# Altium schematic sheet Bpod_Controller_v5.SchDoc: Bpod Controller
size A3; CompanyName: Forschungszentrum Jülich GmbH; DrawnBy: D. Hellenbrandt; Organization: IBI-TAE; Address1: Wilhelm-Johnen-Straße; Address2: 52428 Jülich; DocumentNumber: PWxxxx; Revision: 1; SheetNumber: 1; SheetTotal: 1; Title2: v5; ImagePath: C:\Users\d.hellenbrandt\Bilder\FZJ-Logo.png
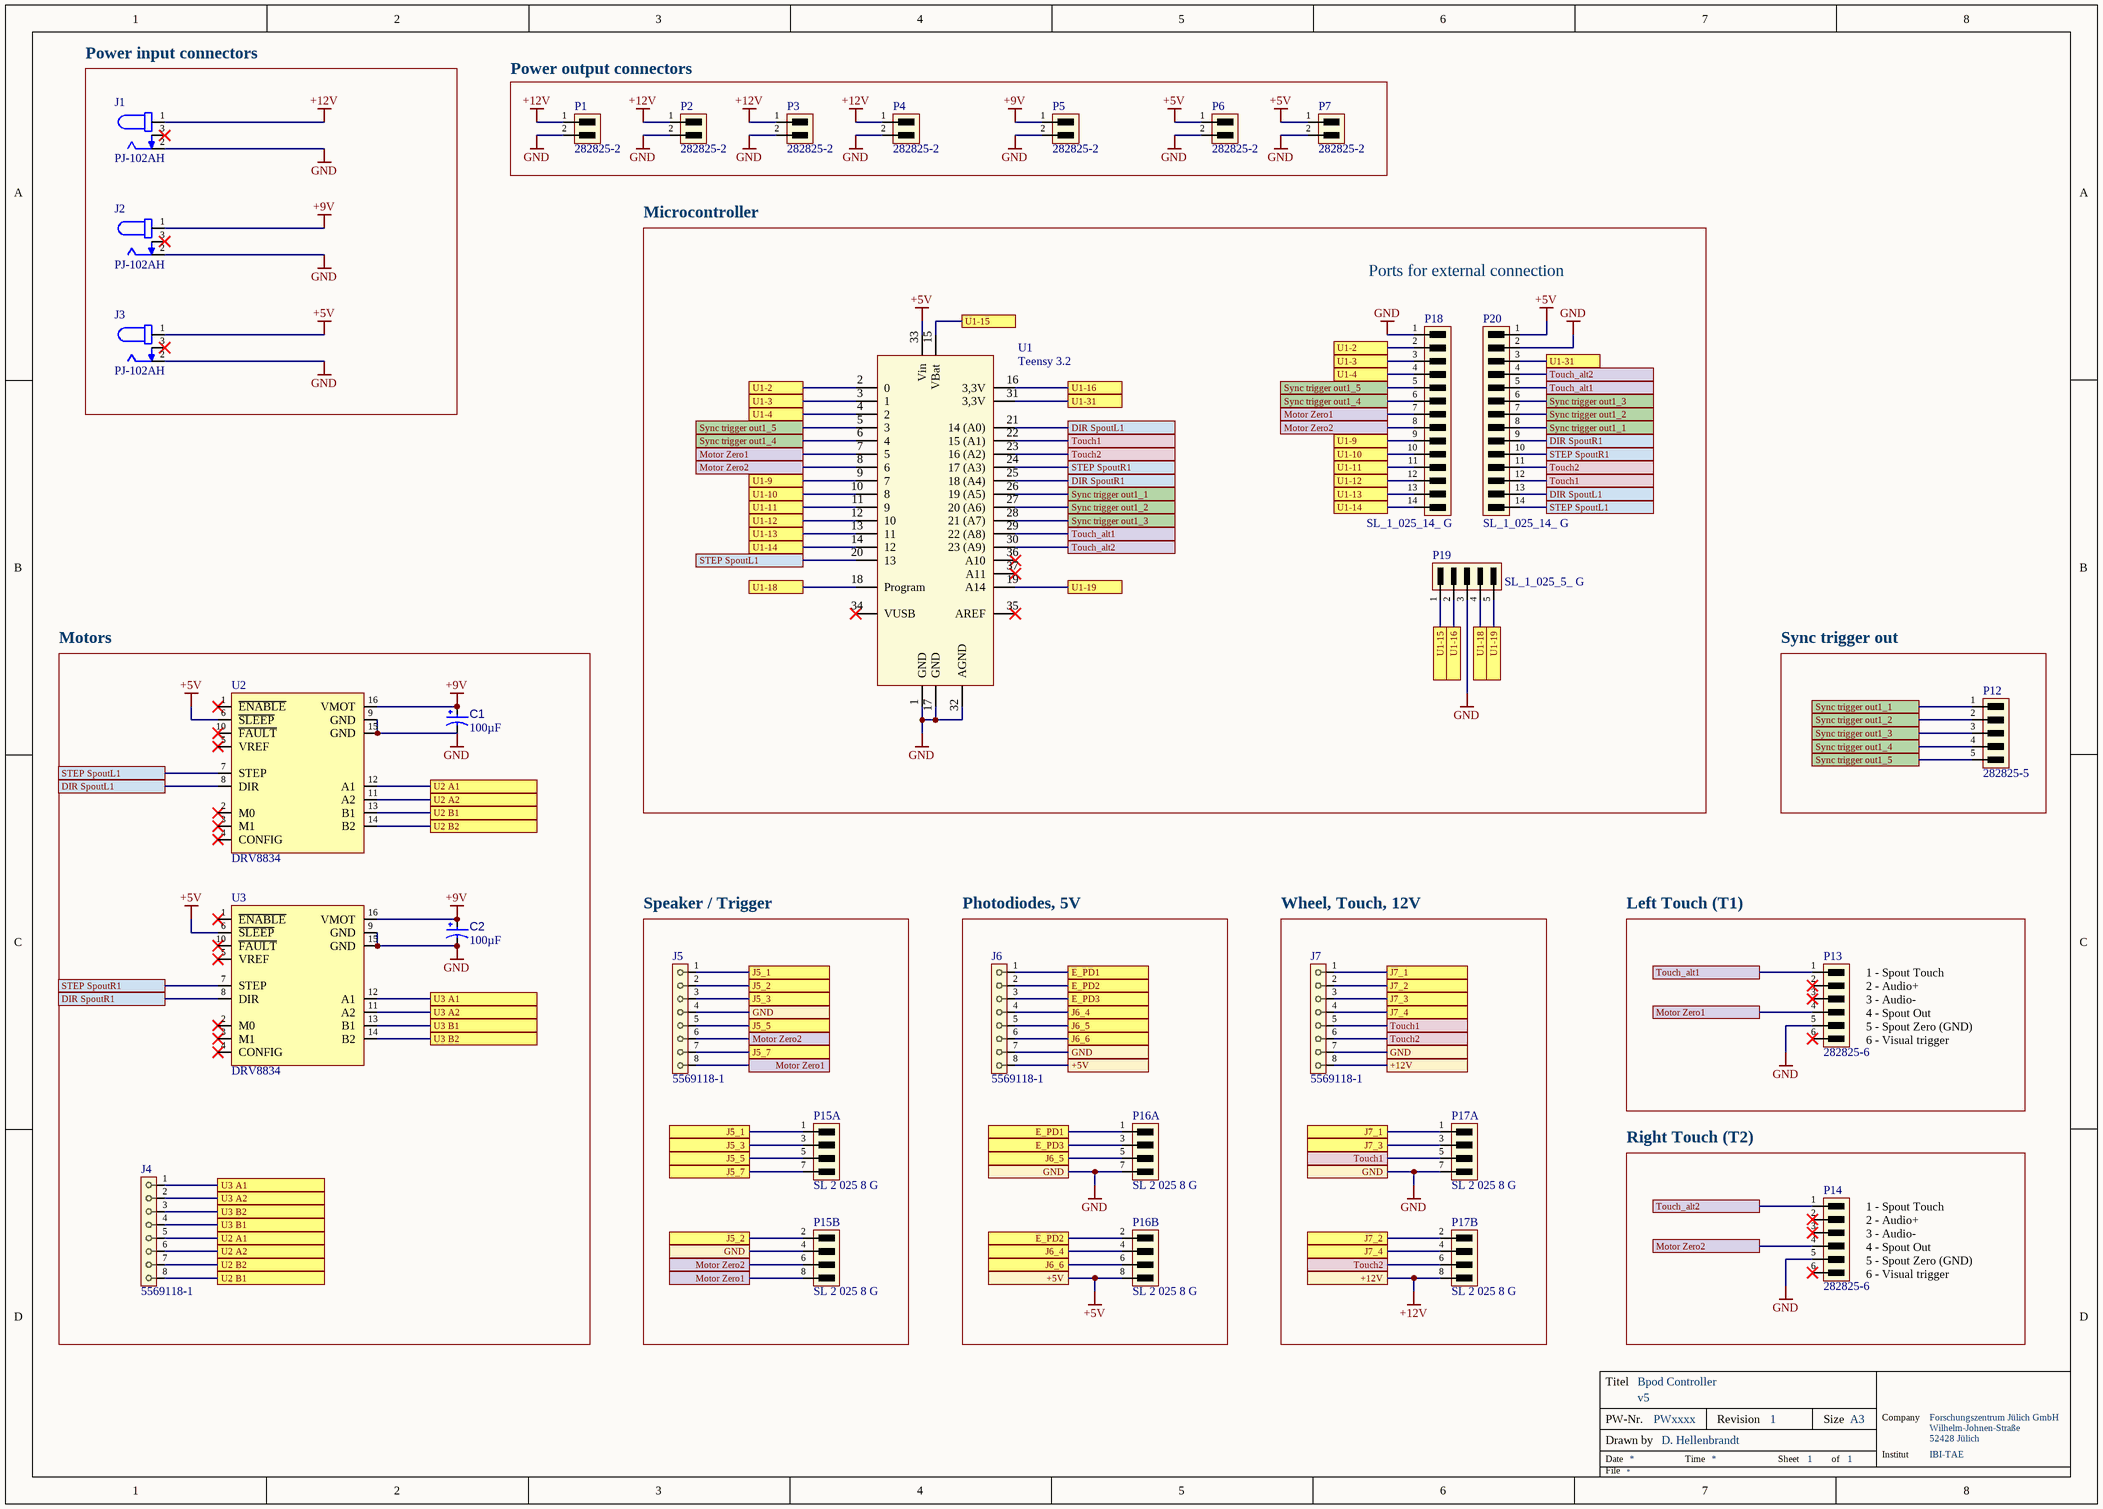
[diagram p0: Bpod_Controller_v5.SchDoc]

## Parts
C1  value 100µF  [AVX-TAJ-C-2_M]  (hidden comment: TAJC107K016RNJ)
C2  value 100µF  [AVX-TAJ-C-2_M]  (hidden comment: TAJC107K016RNJ)
J1  PJ-102AH  [CUI_PJ-102AH]
J2  PJ-102AH  [CUI_PJ-102AH]
J3  PJ-102AH  [CUI_PJ-102AH]
J4  5569118-1  [5569118-1-Footprint-1]
J5  5569118-1  [5569118-1-Footprint-1]
J6  5569118-1  [5569118-1-Footprint-1]
J7  5569118-1  [5569118-1-Footprint-1]
P1  282825-2  [282825-4-Footprint-1]
P2  282825-2  [282825-4-Footprint-1]
P3  282825-2  [282825-4-Footprint-1]
P4  282825-2  [282825-4-Footprint-1]
P5  282825-2  [282825-4-Footprint-1]
P6  282825-2  [282825-4-Footprint-1]
P7  282825-2  [282825-4-Footprint-1]
P12  282825-5  [282825-4-Footprint-1]
P13  282825-6  [282825-4-Footprint-1]
P14  282825-6  [282825-4-Footprint-1]
P15  SL 2 025 8 G  [SL 2 025 2 G-Footprint-1]  (parts A,B of 2)
P16  SL 2 025 8 G  [SL 2 025 2 G-Footprint-1]  (parts A,B of 2)
P17  SL 2 025 8 G  [SL 2 025 2 G-Footprint-1]  (parts A,B of 2)
P18  SL_1_025_14_ G  [SL_1_025_14_ G]
P19  SL_1_025_5_ G  [SL_1_025_5_ G]
P20  SL_1_025_14_ G  [SL_1_025_14_ G]
U1  Teensy 3.2  [New footprint 1]
U2  DRV8834  [DRV8825 STEPPER MOTOR DRIVER CARRIER-Footprint-1]
U3  DRV8834  [DRV8825 STEPPER MOTOR DRIVER CARRIER-Footprint-1]

## Blocks framed on the sheet
Power input connectors: J1-J3
Power output connectors: P1-P7
Motors: C1 C2 J4 U2 U3
Sync trigger out: P12
Speaker / Trigger: J5 P15
Photodiodes, 5V: J6 P16
Wheel, Touch, 12V: J7 P17
Left Touch (T1): P13
Right Touch (T2): P14

## Ports
+5V (see Bpod Controller v5[4D]), +5V (see Bpod Controller v5[5C]), +12V (see Bpod Controller v5[5D]), +12V (see Bpod Controller v5[6C]), DIR SpoutL1 (see Bpod Controller v5[1C], Bpod Controller v5[5B]), DIR SpoutL1 (see Bpod Controller v5[1C], Bpod Controller v5[6B]), DIR SpoutL1 (see Bpod Controller v5[5B], Bpod Controller v5[6B]), DIR SpoutR1 (see Bpod Controller v5[1C], Bpod Controller v5[5B]), DIR SpoutR1 (see Bpod Controller v5[1C], Bpod Controller v5[6B]), DIR SpoutR1 (see Bpod Controller v5[5B], Bpod Controller v5[6B]), E_PD1 (see Bpod Controller v5[4D]), E_PD1 (see Bpod Controller v5[5C]), E_PD2 (see Bpod Controller v5[4D]), E_PD2 (see Bpod Controller v5[5C]), E_PD3 (see Bpod Controller v5[4D]), E_PD3 (see Bpod Controller v5[5C]), GND (see Bpod Controller v5[3C], Bpod Controller v5[3D], Bpod Controller v5[4D], Bpod Controller v5[5C], Bpod Controller v5[5D]), GND (see Bpod Controller v5[3C], Bpod Controller v5[3D], Bpod Controller v5[4D], Bpod Controller v5[5C], Bpod Controller v5[6C]), GND (see Bpod Controller v5[3C], Bpod Controller v5[3D], Bpod Controller v5[4D], Bpod Controller v5[5D], Bpod Controller v5[6C]), GND (see Bpod Controller v5[3C], Bpod Controller v5[3D], Bpod Controller v5[5C], Bpod Controller v5[5D], Bpod Controller v5[6C]), GND (see Bpod Controller v5[3C], Bpod Controller v5[4D], Bpod Controller v5[5C], Bpod Controller v5[5D], Bpod Controller v5[6C]), GND (see Bpod Controller v5[3D], Bpod Controller v5[4D], Bpod Controller v5[5C], Bpod Controller v5[5D], Bpod Controller v5[6C]), J5_1 (see Bpod Controller v5[3C]), J5_1 (see Bpod Controller v5[3D]), J5_2 (see Bpod Controller v5[3C]), J5_2 (see Bpod Controller v5[3D]), J5_3 (see Bpod Controller v5[3C]), J5_3 (see Bpod Controller v5[3D]), J5_5 (see Bpod Controller v5[3C]), J5_5 (see Bpod Controller v5[3D]), J5_7 (see Bpod Controller v5[3C]), J5_7 (see Bpod Controller v5[3D]), J6_4 (see Bpod Controller v5[4D]), J6_4 (see Bpod Controller v5[5C]), J6_5 (see Bpod Controller v5[4D]), J6_5 (see Bpod Controller v5[5C]), J6_6 (see Bpod Controller v5[4D]), J6_6 (see Bpod Controller v5[5C]), J7_1 (see Bpod Controller v5[5D]), J7_1 (see Bpod Controller v5[6C]), J7_2 (see Bpod Controller v5[5D]), J7_2 (see Bpod Controller v5[6C]), J7_3 (see Bpod Controller v5[5D]), J7_3 (see Bpod Controller v5[6C]), J7_4 (see Bpod Controller v5[5D]), J7_4 (see Bpod Controller v5[6C]), Motor Zero1 (see Bpod Controller v5[3B], Bpod Controller v5[3C], Bpod Controller v5[3D], Bpod Controller v5[5B]), Motor Zero1 (see Bpod Controller v5[3B], Bpod Controller v5[3C], Bpod Controller v5[3D], Bpod Controller v5[7C]), Motor Zero1 (see Bpod Controller v5[3B], Bpod Controller v5[3C], Bpod Controller v5[5B], Bpod Controller v5[7C]), Motor Zero1 (see Bpod Controller v5[3B], Bpod Controller v5[3D], Bpod Controller v5[5B], Bpod Controller v5[7C]), Motor Zero1 (see Bpod Controller v5[3C], Bpod Controller v5[3D], Bpod Controller v5[5B], Bpod Controller v5[7C]), Motor Zero2 (see Bpod Controller v5[3B], Bpod Controller v5[3C], Bpod Controller v5[3D], Bpod Controller v5[5B]), Motor Zero2 (see Bpod Controller v5[3B], Bpod Controller v5[3C], Bpod Controller v5[3D], Bpod Controller v5[7D]), Motor Zero2 (see Bpod Controller v5[3B], Bpod Controller v5[3C], Bpod Controller v5[5B], Bpod Controller v5[7D]), Motor Zero2 (see Bpod Controller v5[3B], Bpod Controller v5[3D], Bpod Controller v5[5B], Bpod Controller v5[7D]), Motor Zero2 (see Bpod Controller v5[3C], Bpod Controller v5[3D], Bpod Controller v5[5B], Bpod Controller v5[7D]), STEP SpoutL1 (see Bpod Controller v5[1C], Bpod Controller v5[3B]), STEP SpoutL1 (see Bpod Controller v5[1C], Bpod Controller v5[6B]), STEP SpoutL1 (see Bpod Controller v5[3B], Bpod Controller v5[6B]), STEP SpoutR1 (see Bpod Controller v5[1C], Bpod Controller v5[5B]), STEP SpoutR1 (see Bpod Controller v5[1C], Bpod Controller v5[6B]), STEP SpoutR1 (see Bpod Controller v5[5B], Bpod Controller v5[6B]), Sync trigger out1_1 (see Bpod Controller v5[5B], Bpod Controller v5[6B]), Sync trigger out1_1 (see Bpod Controller v5[5B], Bpod Controller v5[7B]), Sync trigger out1_1 (see Bpod Controller v5[6B], Bpod Controller v5[7B]), Sync trigger out1_2 (see Bpod Controller v5[5B], Bpod Controller v5[6B]), Sync trigger out1_2 (see Bpod Controller v5[5B], Bpod Controller v5[7B]), Sync trigger out1_2 (see Bpod Controller v5[6B], Bpod Controller v5[7B]), Sync trigger out1_3 (see Bpod Controller v5[5B], Bpod Controller v5[6B]), Sync trigger out1_3 (see Bpod Controller v5[5B], Bpod Controller v5[7B]), Sync trigger out1_3 (see Bpod Controller v5[6B], Bpod Controller v5[7B]), Sync trigger out1_4 (see Bpod Controller v5[3B], Bpod Controller v5[5B]), Sync trigger out1_4 (see Bpod Controller v5[3B], Bpod Controller v5[7B]), Sync trigger out1_4 (see Bpod Controller v5[5B], Bpod Controller v5[7B]), Sync trigger out1_5 (see Bpod Controller v5[3B], Bpod Controller v5[5B]), Sync trigger out1_5 (see Bpod Controller v5[3B], Bpod Controller v5[7C]), Sync trigger out1_5 (see Bpod Controller v5[5B], Bpod Controller v5[7C]), Touch1 (see Bpod Controller v5[5B], Bpod Controller v5[5D], Bpod Controller v5[6B]), Touch1 (see Bpod Controller v5[5B], Bpod Controller v5[5D], Bpod Controller v5[6C]), Touch1 (see Bpod Controller v5[5B], Bpod Controller v5[6B], Bpod Controller v5[6C]), Touch1 (see Bpod Controller v5[5D], Bpod Controller v5[6B], Bpod Controller v5[6C]), Touch2 (see Bpod Controller v5[5B], Bpod Controller v5[5D], Bpod Controller v5[6B]), Touch2 (see Bpod Controller v5[5B], Bpod Controller v5[5D], Bpod Controller v5[6C]), Touch2 (see Bpod Controller v5[5B], Bpod Controller v5[6B], Bpod Controller v5[6C]), Touch2 (see Bpod Controller v5[5D], Bpod Controller v5[6B], Bpod Controller v5[6C]), Touch_alt1 (see Bpod Controller v5[5B], Bpod Controller v5[6B]), Touch_alt1 (see Bpod Controller v5[5B], Bpod Controller v5[7C]), Touch_alt1 (see Bpod Controller v5[6B], Bpod Controller v5[7C]), Touch_alt2 (see Bpod Controller v5[5B], Bpod Controller v5[6A]), Touch_alt2 (see Bpod Controller v5[5B], Bpod Controller v5[7D]), Touch_alt2 (see Bpod Controller v5[6A], Bpod Controller v5[7D]), U1-2 (see Bpod Controller v5[3B]), U1-2 (see Bpod Controller v5[6A]), U1-3 (see Bpod Controller v5[3B]), U1-3 (see Bpod Controller v5[6A]), U1-4 (see Bpod Controller v5[3B]), U1-4 (see Bpod Controller v5[6A]), U1-9 (see Bpod Controller v5[3B]), U1-9 (see Bpod Controller v5[6B]), U1-10 (see Bpod Controller v5[3B]), U1-10 (see Bpod Controller v5[6B]), U1-11 (see Bpod Controller v5[3B]), U1-11 (see Bpod Controller v5[6B]), U1-12 (see Bpod Controller v5[3B]), U1-12 (see Bpod Controller v5[6B]), U1-13 (see Bpod Controller v5[3B]), U1-13 (see Bpod Controller v5[6B]), U1-14 (see Bpod Controller v5[3B]), U1-14 (see Bpod Controller v5[6B]), U1-15 (see Bpod Controller v5[4A]), U1-15 (see Bpod Controller v5[6B]), U1-16 (see Bpod Controller v5[5B]), U1-16 (see Bpod Controller v5[6B]), U1-18 (see Bpod Controller v5[3B]), U1-18 (see Bpod Controller v5[6B]), U1-19 (see Bpod Controller v5[5B]), U1-19 (see Bpod Controller v5[6B]), U1-31 (see Bpod Controller v5[5B]), U1-31 (see Bpod Controller v5[6A]), U2 A1 (see Bpod Controller v5[1D]), U2 A1 (see Bpod Controller v5[2C]), U2 A2 (see Bpod Controller v5[1D]), U2 A2 (see Bpod Controller v5[2C]), U2 B1 (see Bpod Controller v5[1D]), U2 B1 (see Bpod Controller v5[2C]), U2 B2 (see Bpod Controller v5[1D]), U2 B2 (see Bpod Controller v5[2C]), U3 A1 (see Bpod Controller v5[1D]), U3 A1 (see Bpod Controller v5[2C]), U3 A2 (see Bpod Controller v5[1D]), U3 A2 (see Bpod Controller v5[2C]), U3 B1 (see Bpod Controller v5[1D]), U3 B1 (see Bpod Controller v5[2C]), U3 B2 (see Bpod Controller v5[1D]), U3 B2 (see Bpod Controller v5[2C])

## Nets
+5V: J3.1 J6.8 P6.1 P7.1 P16.8 P20.1 U1.33(Vin) U2.6(~{SLEEP}) U3.6(~{SLEEP}) ; port +5V
+9V: C1.1 C2.1 J2.1 P5.1 U2.16(VMOT) U3.16(VMOT)
+12V: J1.1 J7.8 P1.1 P2.1 P3.1 P4.1 P17.8 ; port +12V
GND: C1.2 C2.2 J1.2 J2.2 J3.2 J5.4 J6.7 J7.7 P1.2 P2.2 P3.2 P4.2 P5.2 P6.2 P7.2 P13.5 P14.5 P15.4 P16.7 P17.7 P18.1 P19.3 P20.2 U1.1(GND) U1.17(GND) U1.32(AGND) U2.9(GND) U2.15(GND) U3.9(GND) U3.15(GND) ; port GND
DIR SpoutL1: P20.13 U1.21(14_(A0)) U2.8(DIR) ; port DIR SpoutL1
DIR SpoutR1: P20.9 U1.25(18_(A4)) U3.8(DIR) ; port DIR SpoutR1
E_PD1: J6.1 P16.1 ; port E_PD1
E_PD2: J6.2 P16.2 ; port E_PD2
E_PD3: J6.3 P16.3 ; port E_PD3
J5_1: J5.1 P15.1 ; port J5_1
J5_2: J5.2 P15.2 ; port J5_2
J5_3: J5.3 P15.3 ; port J5_3
J5_5: J5.5 P15.5 ; port J5_5
J5_7: J5.7 P15.7 ; port J5_7
J6_4: J6.4 P16.4 ; port J6_4
J6_5: J6.5 P16.5 ; port J6_5
J6_6: J6.6 P16.6 ; port J6_6
J7_1: J7.1 P17.1 ; port J7_1
J7_2: J7.2 P17.2 ; port J7_2
J7_3: J7.3 P17.3 ; port J7_3
J7_4: J7.4 P17.4 ; port J7_4
Motor Zero1: J5.8 P13.4 P15.8 P18.7 U1.7(5) ; port Motor Zero1
Motor Zero2: J5.6 P14.4 P15.6 P18.8 U1.8(6) ; port Motor Zero2
STEP SpoutL1: P20.14 U1.20(13) U2.7(STEP) ; port STEP SpoutL1
STEP SpoutR1: P20.10 U1.24(17_(A3)) U3.7(STEP) ; port STEP SpoutR1
Sync trigger out1_1: P12.1 P20.8 U1.26(19_(A5)) ; port Sync trigger out1_1
Sync trigger out1_2: P12.2 P20.7 U1.27(20_(A6)) ; port Sync trigger out1_2
Sync trigger out1_3: P12.3 P20.6 U1.28(21_(A7)) ; port Sync trigger out1_3
Sync trigger out1_4: P12.4 P18.6 U1.6(4) ; port Sync trigger out1_4
Sync trigger out1_5: P12.5 P18.5 U1.5(3) ; port Sync trigger out1_5
Touch1: J7.5 P17.5 P20.12 U1.22(15_(A1)) ; port Touch1
Touch2: J7.6 P17.6 P20.11 U1.23(16_(A2)) ; port Touch2
Touch_alt1: P13.1 P20.5 U1.29(22_(A8)) ; port Touch_alt1
Touch_alt2: P14.1 P20.4 U1.30(23_(A9)) ; port Touch_alt2
U1-2: P18.2 U1.2(0) ; port U1-2
U1-3: P18.3 U1.3(1) ; port U1-3
U1-4: P18.4 U1.4(2) ; port U1-4
U1-9: P18.9 U1.9(7) ; port U1-9
U1-10: P18.10 U1.10(8) ; port U1-10
U1-11: P18.11 U1.11(9) ; port U1-11
U1-12: P18.12 U1.12(10) ; port U1-12
U1-13: P18.13 U1.13(11) ; port U1-13
U1-14: P18.14 U1.14(12) ; port U1-14
U1-15: P19.1 U1.15(VBat) ; port U1-15
U1-16: P19.2 U1.16(3,3V) ; port U1-16
U1-18: P19.4 U1.18(Program) ; port U1-18
U1-19: P19.5 U1.19(A14) ; port U1-19
U1-31: P20.3 U1.31(3,3V) ; port U1-31
U2 A1: J4.5 U2.12(A1) ; port U2 A1
U2 A2: J4.6 U2.11(A2) ; port U2 A2
U2 B1: J4.8 U2.13(B1) ; port U2 B1
U2 B2: J4.7 U2.14(B2) ; port U2 B2
U3 A1: J4.1 U3.12(A1) ; port U3 A1
U3 A2: J4.2 U3.11(A2) ; port U3 A2
U3 B1: J4.4 U3.13(B1) ; port U3 B1
U3 B2: J4.3 U3.14(B2) ; port U3 B2

Not connected (* = marked no-connect by the designer): J1 3*; J2 3*; J3 3*; P13 2* 3* 6*; P14 2* 3* 6*; U1 34(VUSB)* 35(AREF)* 36(A10)* 37(A11)*; U2 1(~{ENABLE})* 2(M0)* 3(M1)* 4(CONFIG)* 5(VREF)* 10(~{FAULT})*; U3 1(~{ENABLE})* 2(M0)* 3(M1)* 4(CONFIG)* 5(VREF)* 10(~{FAULT})*

## Notes on the sheet
- Microcontroller
- Ports for external connection
- (near P13) 1 - Spout Touch
  2 - Audio+
  3 - Audio-
  4 - Spout Out
  5 - Spout Zero (GND)
  6 - Visual trigger
- (near P14) 1 - Spout Touch
  2 - Audio+
  3 - Audio-
  4 - Spout Out
  5 - Spout Zero (GND)
  6 - Visual trigger
- Titel
- PW-Nr.
- Date
- Drawn by
- Time
- Revision
- Sheet
- Size
- of
- A3
- Institut
- Company
- File

## Library data of the parts
C1 C2 = CMP-001-00046-9: Standard Tantalum, 100 uF, +/- 10%, 16 V, -55 to 125 degC, 2312 (6032 Metric), RoHS, Tape and Reel; Manufacturer: AVX; Voltage Rating: 16V; Resistance: 1Ohm; Package Quantity: 500; Max Operating Temperature: 125°C; Datasheet URL: http://datasheets.avx.com/TAJ.pdf; Case/Package: 2412; RoHS Compliant: True; Tolerance: 10%; Manufacturer URL: http://www.avx.com/; Packaging: TapeandReel; Package Reference: TAJ-C-2; Min Operating Temperature: -55°C; Package Description: 2-Pin Surface Mount Device, Body 6 x 3.25 mm; Mounting Technology: SM; ESR: 1Ohm; Capacitor Type: Tantalum; Datasheet Version: Feb-16
J1-J3 = CMP-00027-00002-5: 12V, 2.5A, 2mm Dia; user: IBI-TAE; Pins: 3; Mounting Technology: Board; RoHS Compliant: Yes
J4-J7 = CMP-002-00096-6: Telecom and Datacom Connector, 8 Contact(s), Female, Right Angle, Solder Terminal, Locking, Jack; User: IBI-TAE; RoHS Compliant: Yes; Min Operating Temperature: -40°C; Mounting Technology: Panel,Board; Max Operating Temperature: 85°C; Connector Type: TELECOM AND DATACOM CONNECTOR; Case/Package: RJ45; Pins: 8
P1-P7 = CMP-002-00093-3: Strip Terminal Block, 15A, 1 Row(s), 1 Deck(s); Gender: male; Connector Type: Pluggable Terminal Block; user: IBI-TAE; Voltage Rating: 300V; RoHS Compliant: Yes; Max Current Rating: 15A; Mounting Technology: Board; Pins: 4
P12 = CMP-002-00091-4: Strip Terminal Block, 15A, 1 Row(s), 1 Deck(s); Connector Type: Pluggable Terminal Block; user: IBI-TAE; Gender: male; Voltage Rating: 300V; Pins: 5; Mounting Technology: Board; RoHS Compliant: Yes; Max Current Rating: 15A
P13 P14 = CMP-002-00092-4: Strip Terminal Block, 15A, 1 Row(s), 1 Deck(s); Gender: male; Connector Type: Pluggable Terminal Block; Voltage Rating: 300V; user: IBI-TAE; Pins: 6; Max Current Rating: 15A; RoHS Compliant: Yes; Mounting Technology: Board
P15-P17 = CMP-002-00101-2: Fischer  SL 2 025 8 G, Stiftleiste, 2 Reiheb, 8 Pole, vergoldet; Number of Rows Loaded: 2; Connector Type: BOARD CONNECTOR; Gender: male; Number of Contacts: 8; user: IBI-TAE; Voltage Rating: 300V; Max Current Rating: 3A; Contact Finish - Mating: GOLD; Mounting Technology: Board; RoHS Compliant: Yes; Contact Gender: Male; Terminal Pitch: 2.54mm; Mounting Style: STRAIGHT; Contact Finish - Termination: GOLD; Pins: 6
P18 P20 = CMP-002-00107-2: Fischer SL_1_025_14_ G, Stiftleiste, 1 Reiheb, 14 Pole, vergoldet; Max Current Rating: 3A; user: IBI-TAE; Voltage Rating: 300V; Connector Type: BOARD CONNECTOR; Number of Contacts: 14; Number of Rows Loaded: 1; Gender: male; Mounting Style: STRAIGHT; Contact Gender: Male; Terminal Pitch: 2.54mm; Pins: 14; RoHS Compliant: Yes; Mounting Technology: Board; Contact Finish - Mating: GOLD; Contact Finish - Termination: GOLD
P19 = CMP-002-00106-1: Fischer SL_1_025_5_ G, Stiftleiste, 1 Reiheb, 5 Pole, vergoldet; Max Current Rating: 3A; Voltage Rating: 300V; Gender: male; user: IBI-TAE; Number of Rows Loaded: 1; Connector Type: BOARD CONNECTOR; Number of Contacts: 5; Mounting Style: STRAIGHT; Terminal Pitch: 2.54mm; Pins: 5; Contact Finish - Termination: GOLD; RoHS Compliant: Yes; Mounting Technology: Board; Contact Gender: Male; Contact Finish - Mating: GOLD
U1 = CMP-00000-6: Development Boards & Kits, ARM Teensy 3.2 and header; user: IBI-TAE
U2 U3 = CMP-00024-00007-1: DRV8834 Low-Voltage Stepper Motor Driver Carrier; Min Supply Voltage: 2,5V; Max current per phase: 2A; Continuous current per phase: 1,5A; user: IBI-TAE; Max Supply Voltage: 10,8V; website: https://www.pololu.com/product/2134; Pins: 16